# Altium project VISION_BETA_EBB.PrjPcb (part 3 of 9)

## Sheet USB.SchDoc
size D; SheetNumber: 4; SheetTotal: 18
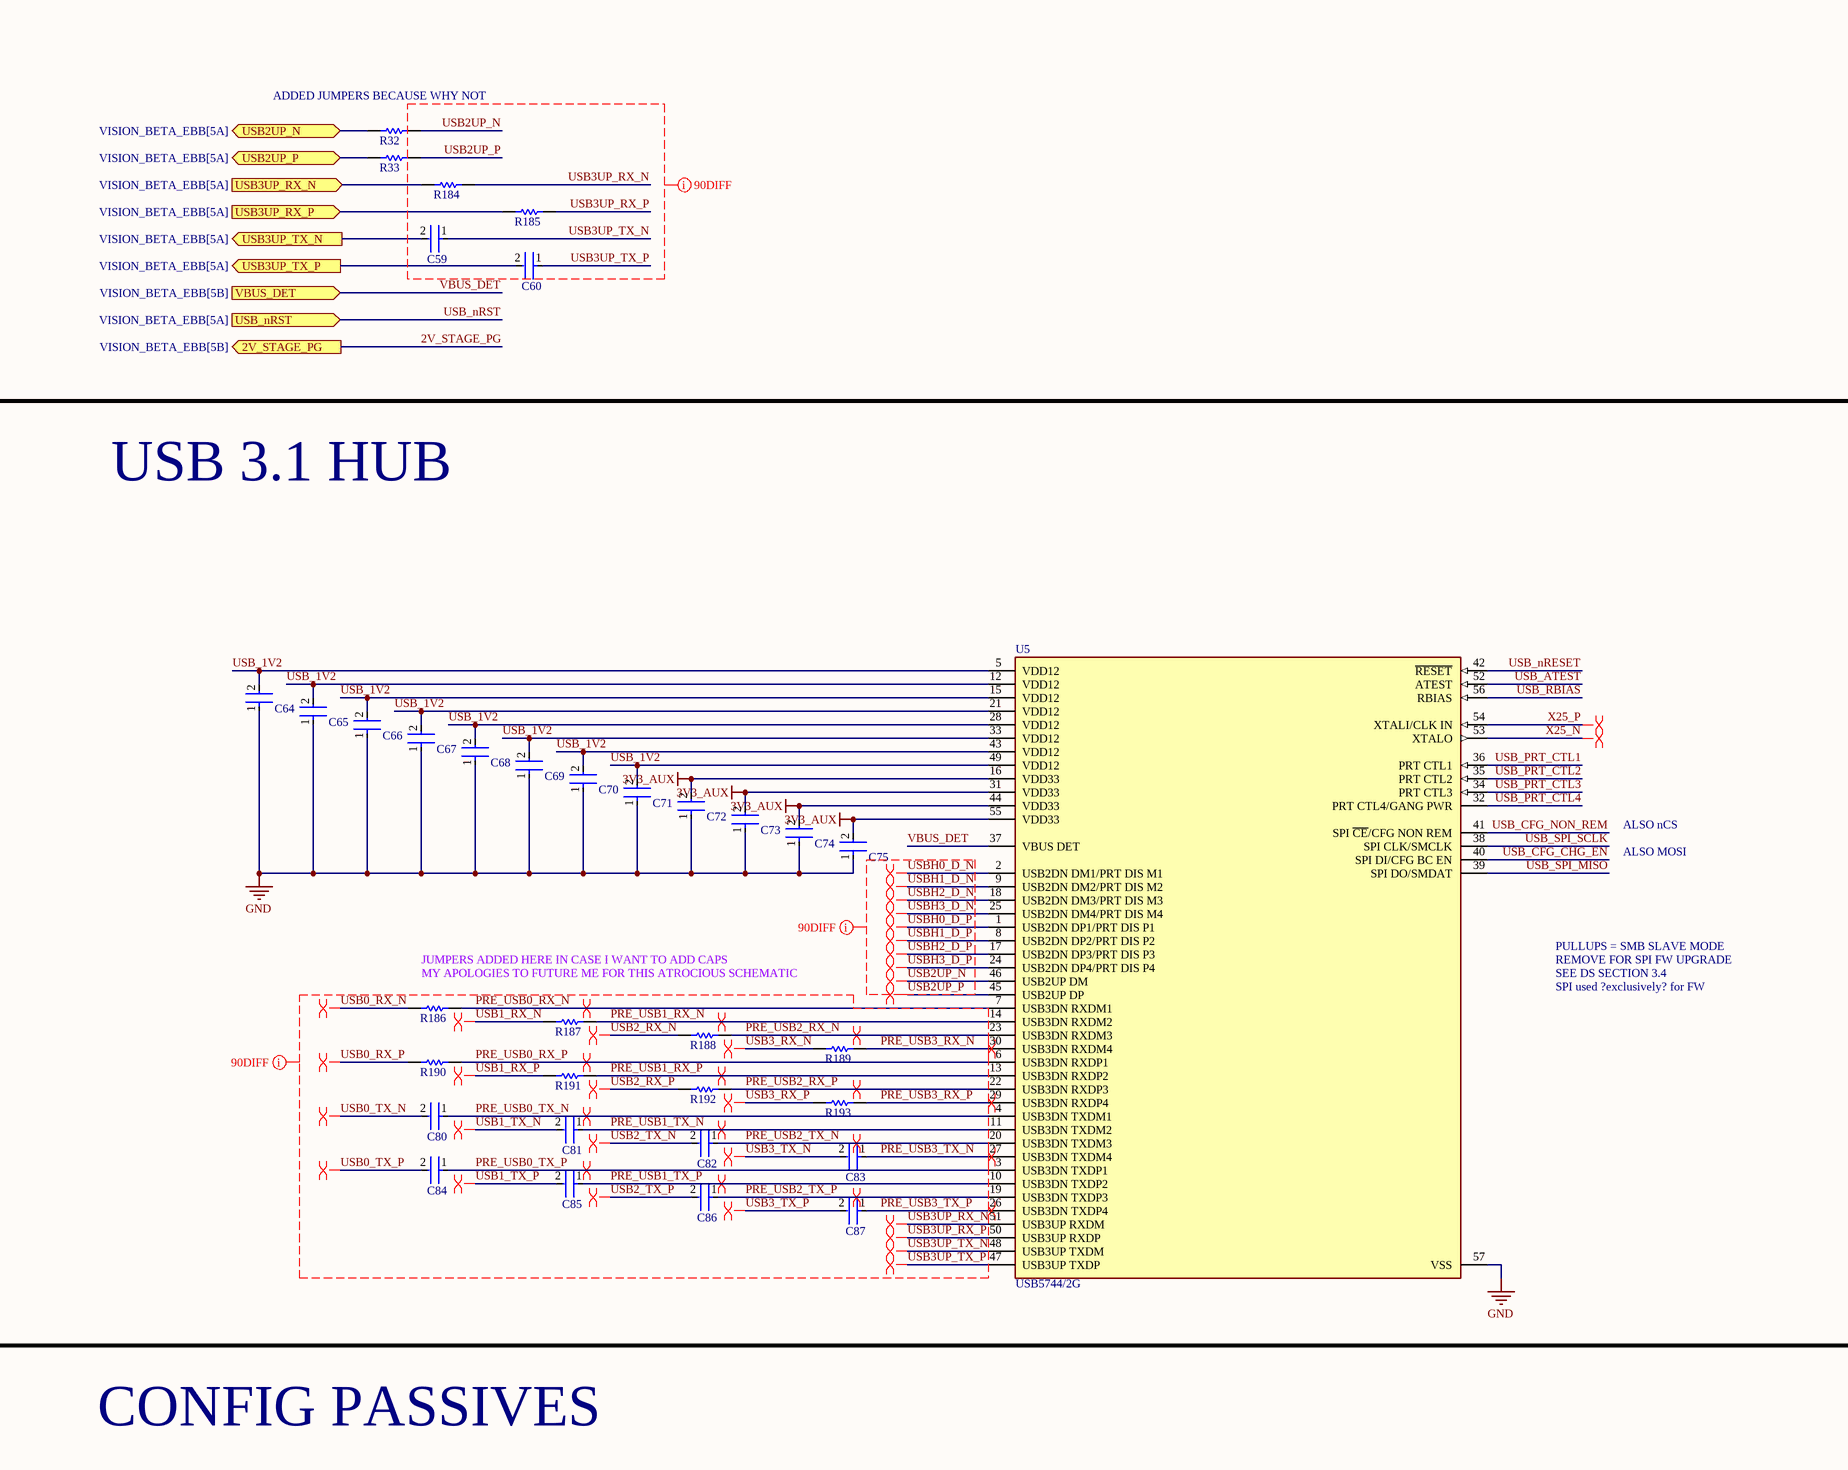
[diagram p14: USB.SchDoc, top left]
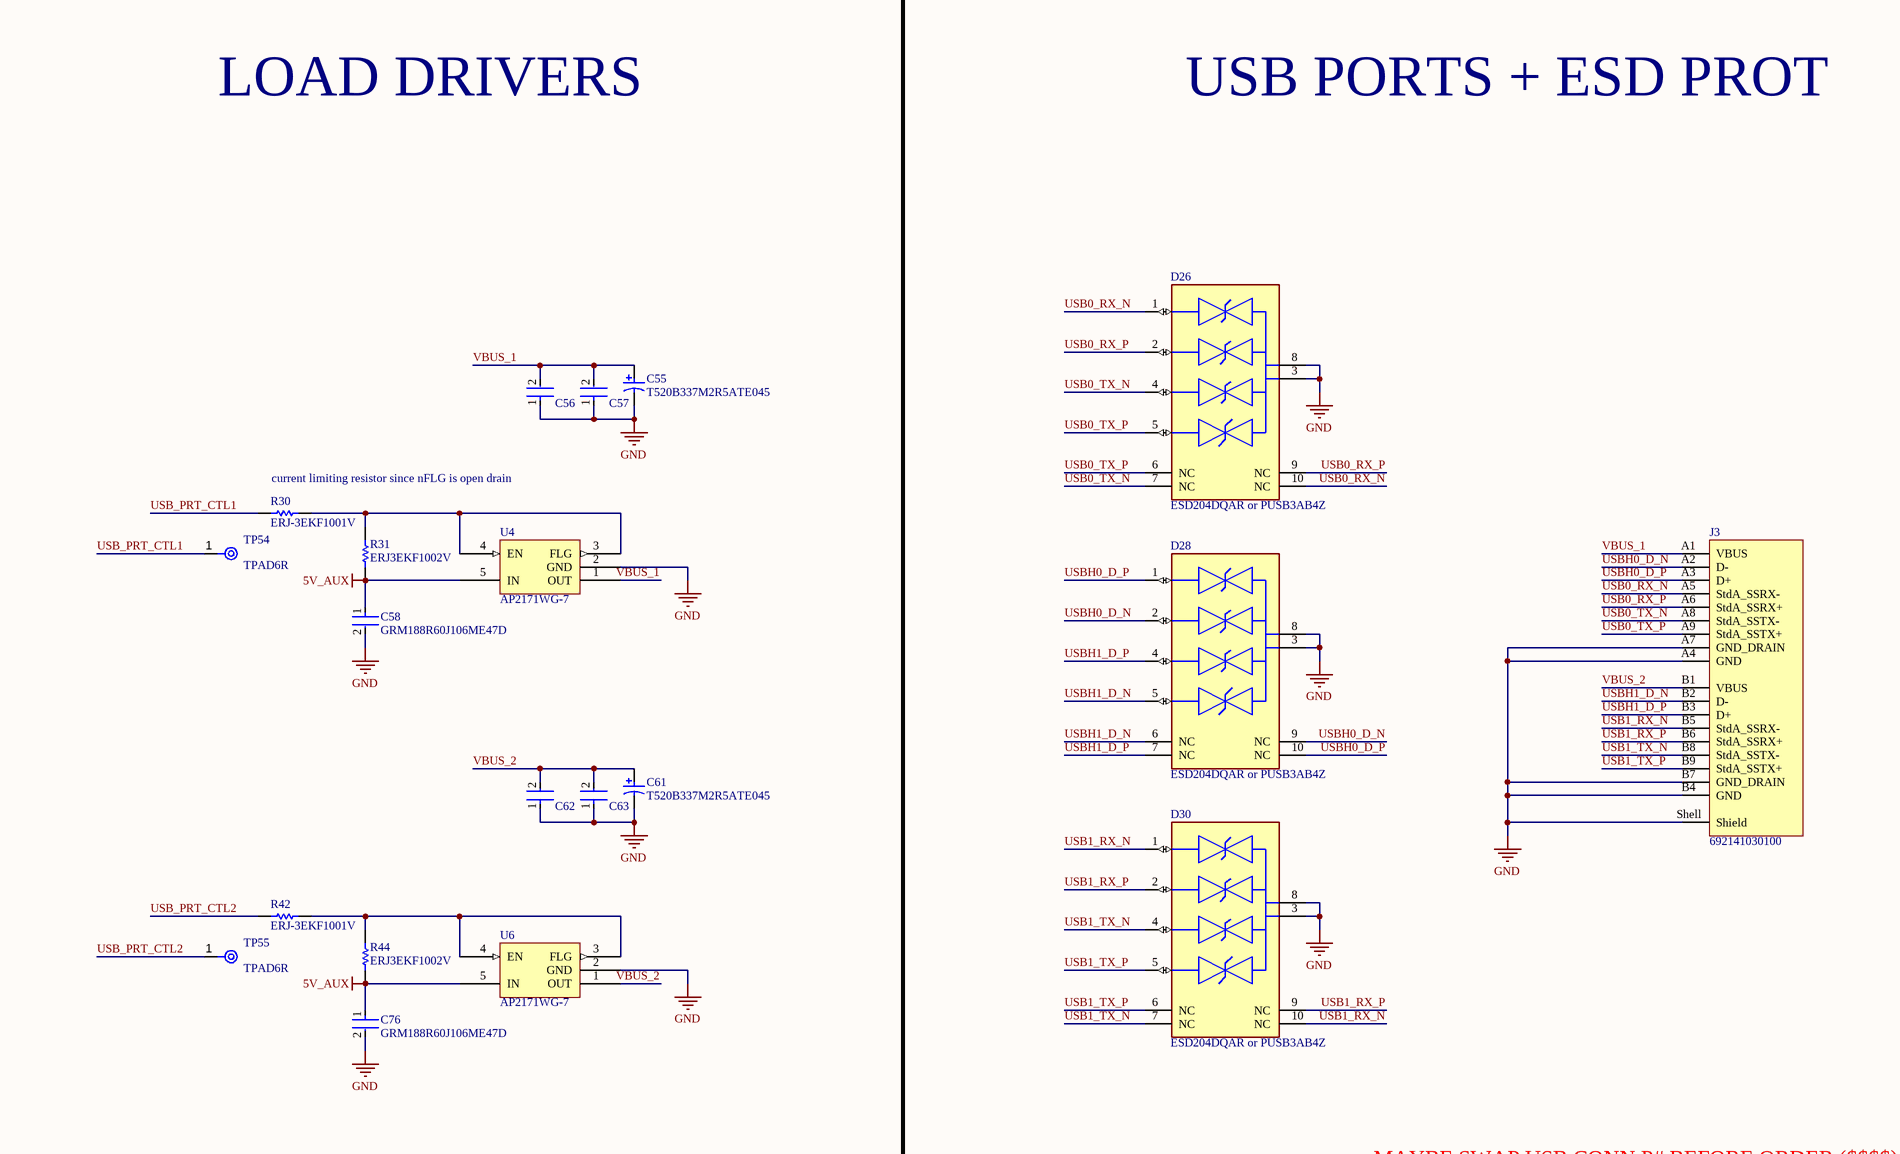
[diagram p15: USB.SchDoc, top right]
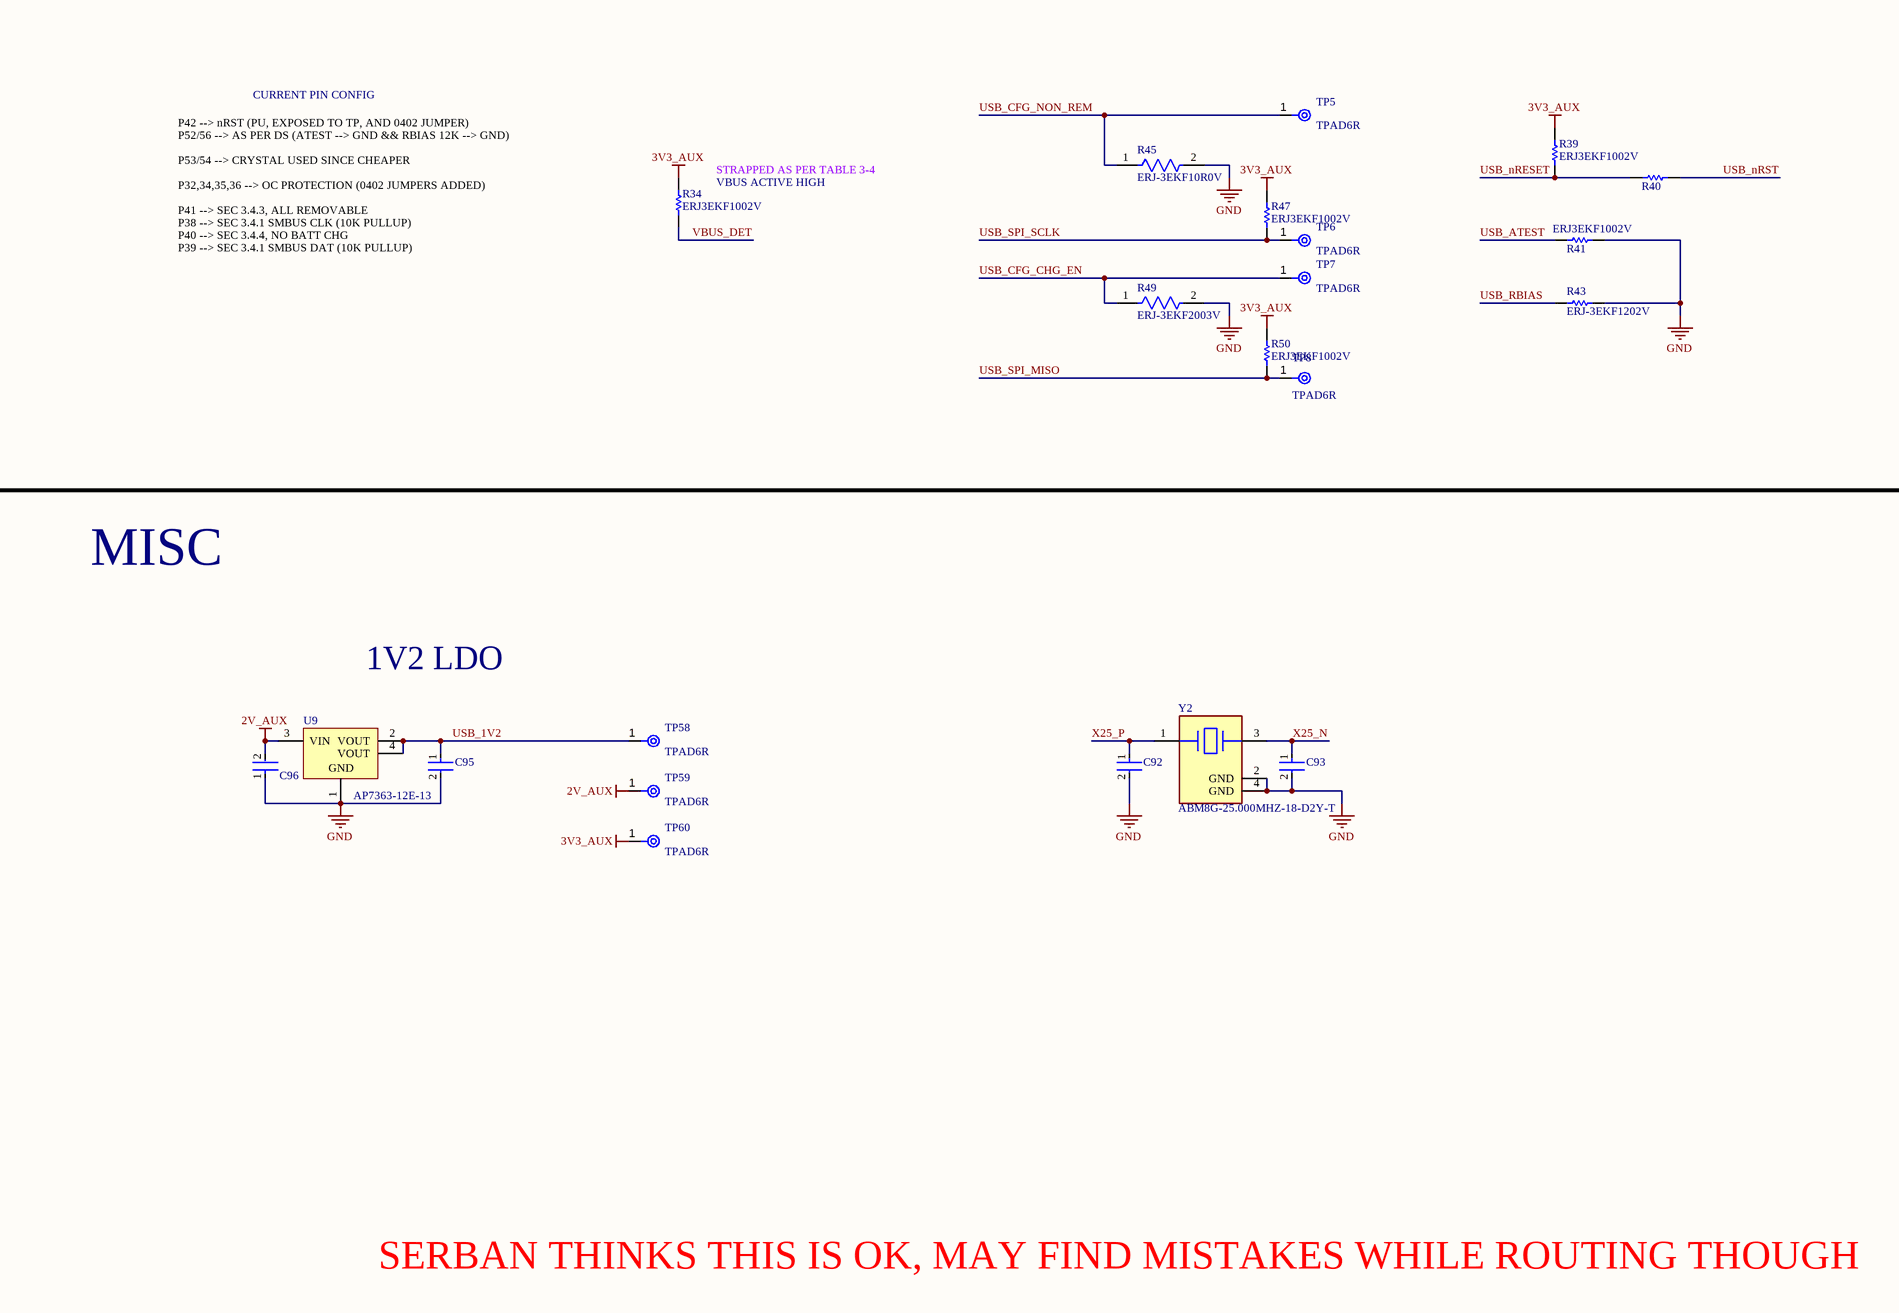
[diagram p16: USB.SchDoc, bottom left]
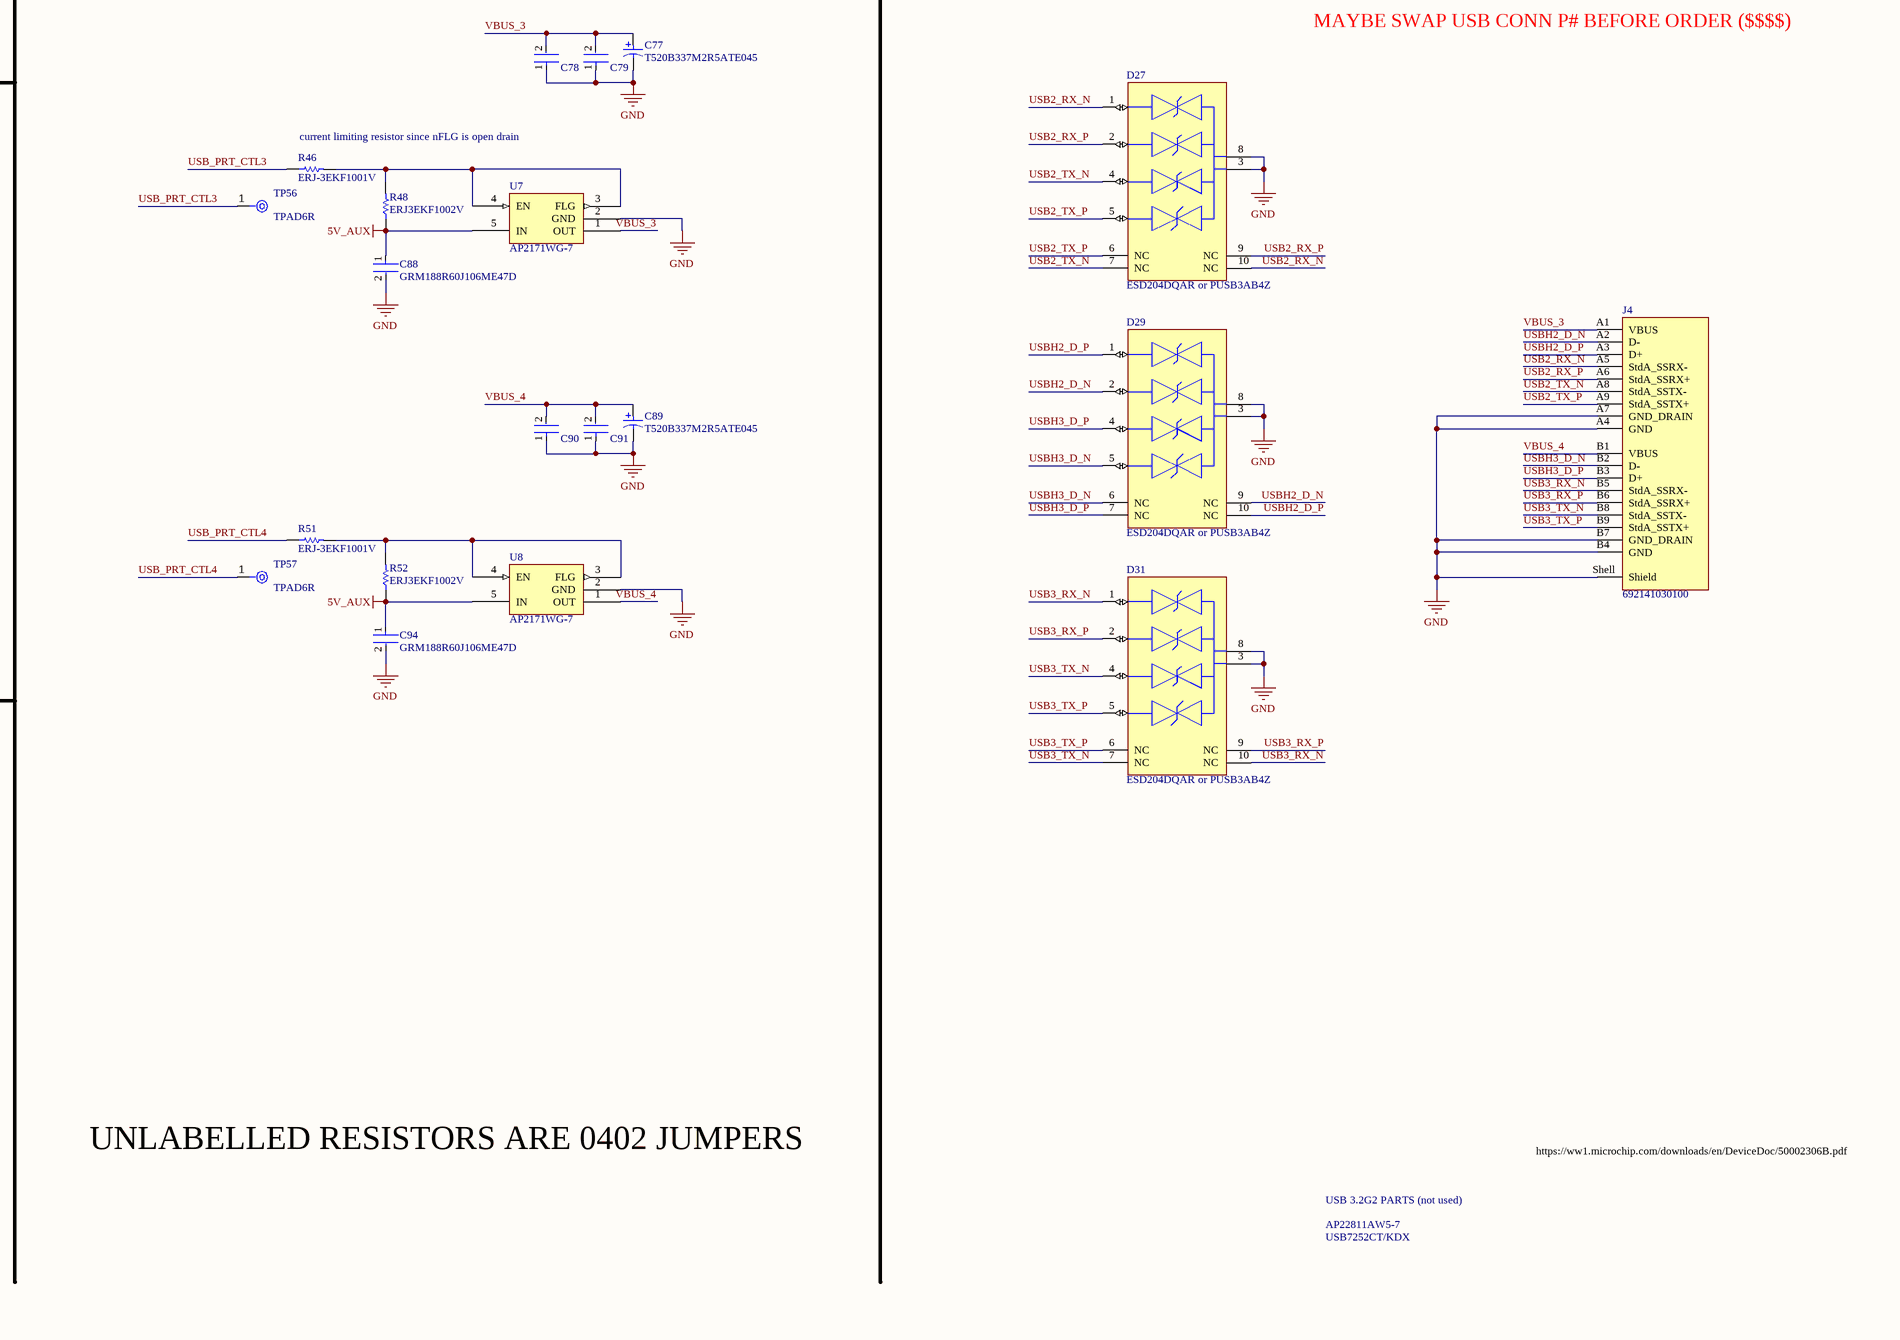
[diagram p17: USB.SchDoc, bottom right]

### Parts
C55  T520B337M2R5ATE045  [KEMT-520-B-2_M]
C56  C1005X7R1H104K050BB  [FP-C1005-050-0_05-IPC_C]  (value not drawn)
C57  C1005X7R1H104K050BB  [FP-C1005-050-0_05-IPC_C]  (value not drawn)
C58  GRM188R60J106ME47D  [FP-GRM188-0_1-e0_2_0_55-IPC_A]
C59  C1005X7R1H104K050BB  [FP-C1005-050-0_05-IPC_C]  (value not drawn)
C60  C1005X7R1H104K050BB  [FP-C1005-050-0_05-IPC_C]  (value not drawn)
C61  T520B337M2R5ATE045  [KEMT-520-B-2_M]
C62  C1005X7R1H104K050BB  [FP-C1005-050-0_05-IPC_C]  (value not drawn)
C63  C1005X7R1H104K050BB  [FP-C1005-050-0_05-IPC_C]  (value not drawn)
C64  C1005X7R1H104K050BB  [FP-C1005-050-0_05-IPC_C]  (value not drawn)
C65  C1005X7R1H104K050BB  [FP-C1005-050-0_05-IPC_C]  (value not drawn)
C66  C1005X7R1H104K050BB  [FP-C1005-050-0_05-IPC_C]  (value not drawn)
C67  C1005X7R1H104K050BB  [FP-C1005-050-0_05-IPC_C]  (value not drawn)
C68  C1005X7R1H104K050BB  [FP-C1005-050-0_05-IPC_C]  (value not drawn)
C69  C1005X7R1H104K050BB  [FP-C1005-050-0_05-IPC_C]  (value not drawn)
C70  C1005X7R1H104K050BB  [FP-C1005-050-0_05-IPC_C]  (value not drawn)
C71  C1005X7R1H104K050BB  [FP-C1005-050-0_05-IPC_C]  (value not drawn)
C72  C1005X7R1H104K050BB  [FP-C1005-050-0_05-IPC_C]  (value not drawn)
C73  C1005X7R1H104K050BB  [FP-C1005-050-0_05-IPC_C]  (value not drawn)
C74  C1005X7R1H104K050BB  [FP-C1005-050-0_05-IPC_C]  (value not drawn)
C75  C1005X7R1H104K050BB  [FP-C1005-050-0_05-IPC_C]  (value not drawn)
C76  GRM188R60J106ME47D  [FP-GRM188-0_1-e0_2_0_55-IPC_A]
C77  T520B337M2R5ATE045  [KEMT-520-B-2_M]
C78  C1005X7R1H104K050BB  [FP-C1005-050-0_05-IPC_C]  (value not drawn)
C79  C1005X7R1H104K050BB  [FP-C1005-050-0_05-IPC_C]  (value not drawn)
C80  C1005X7R1H104K050BB  [FP-C1005-050-0_05-IPC_C]  (value not drawn)
C81  C1005X7R1H104K050BB  [FP-C1005-050-0_05-IPC_C]  (value not drawn)
C82  C1005X7R1H104K050BB  [FP-C1005-050-0_05-IPC_C]  (value not drawn)
C83  C1005X7R1H104K050BB  [FP-C1005-050-0_05-IPC_C]  (value not drawn)
C84  C1005X7R1H104K050BB  [FP-C1005-050-0_05-IPC_C]  (value not drawn)
C85  C1005X7R1H104K050BB  [FP-C1005-050-0_05-IPC_C]  (value not drawn)
C86  C1005X7R1H104K050BB  [FP-C1005-050-0_05-IPC_C]  (value not drawn)
C87  C1005X7R1H104K050BB  [FP-C1005-050-0_05-IPC_C]  (value not drawn)
C88  GRM188R60J106ME47D  [FP-GRM188-0_1-e0_2_0_55-IPC_A]
C89  T520B337M2R5ATE045  [KEMT-520-B-2_M]
C90  C1005X7R1H104K050BB  [FP-C1005-050-0_05-IPC_C]  (value not drawn)
C91  C1005X7R1H104K050BB  [FP-C1005-050-0_05-IPC_C]  (value not drawn)
C92  C0603C300J5GACTU  [FP-C0603C-CF-MFG]  (value not drawn)
C93  C0603C300J5GACTU  [FP-C0603C-CF-MFG]  (value not drawn)
C94  GRM188R60J106ME47D  [FP-GRM188-0_1-e0_2_0_55-IPC_A]
C95  GRM188R60J106ME47D  [FP-GRM188-0_1-e0_2_0_55-IPC_A]  (value not drawn)
C96  C1005X7R1H104K050BB  [FP-C1005-050-0_05-IPC_C]  (value not drawn)
D26  ESD204DQAR or PUSB3AB4Z  [FP-DQA0010A-MFG]
D27  ESD204DQAR or PUSB3AB4Z  [FP-DQA0010A-MFG]
D28  ESD204DQAR or PUSB3AB4Z  [FP-DQA0010A-MFG]
D29  ESD204DQAR or PUSB3AB4Z  [FP-DQA0010A-MFG]
D30  ESD204DQAR or PUSB3AB4Z  [FP-DQA0010A-MFG]
D31  ESD204DQAR or PUSB3AB4Z  [FP-DQA0010A-MFG]
J3  692141030100  [692141030100]
J4  692141030100  [692141030100]
R30  ERJ-3EKF1001V  [RESC1608X55X30LL15T15]
R31  ERJ3EKF1002V  [RESC1609X55X30LL15T15]
R32  0402 JUMPER  [RESC1005X40X25ML05T05]  (value not drawn)
R33  0402 JUMPER  [RESC1005X40X25ML05T05]  (value not drawn)
R34  ERJ3EKF1002V  [RESC1609X55X30LL15T15]
R39  ERJ3EKF1002V  [RESC1609X55X30LL15T15]
R40  0402 JUMPER  [RESC1005X40X25ML05T05]  (value not drawn)
R41  ERJ3EKF1002V  [RESC1609X55X30LL15T15]
R42  ERJ-3EKF1001V  [RESC1608X55X30LL15T15]
R43  ERJ-3EKF1202V  [RESC1609X55X30ML15T15]
R44  ERJ3EKF1002V  [RESC1609X55X30LL15T15]
R45  ERJ-3EKF10R0V  [FP-ERJ3EK-MFG]
R46  ERJ-3EKF1001V  [RESC1608X55X30LL15T15]
R47  ERJ3EKF1002V  [RESC1609X55X30LL15T15]
R48  ERJ3EKF1002V  [RESC1609X55X30LL15T15]
R49  ERJ-3EKF2003V  [FP-ERJ3EK-IPC_B]
R50  ERJ3EKF1002V  [RESC1609X55X30LL15T15]
R51  ERJ-3EKF1001V  [RESC1608X55X30LL15T15]
R52  ERJ3EKF1002V  [RESC1609X55X30LL15T15]
R184  0402 JUMPER  [RESC1005X40X25ML05T05]  (value not drawn)
R185  0402 JUMPER  [RESC1005X40X25ML05T05]  (value not drawn)
R186  0402 JUMPER  [RESC1005X40X25ML05T05]  (value not drawn)
R187  0402 JUMPER  [RESC1005X40X25ML05T05]  (value not drawn)
R188  0402 JUMPER  [RESC1005X40X25ML05T05]  (value not drawn)
R189  0402 JUMPER  [RESC1005X40X25ML05T05]  (value not drawn)
R190  0402 JUMPER  [RESC1005X40X25ML05T05]  (value not drawn)
R191  0402 JUMPER  [RESC1005X40X25ML05T05]  (value not drawn)
R192  0402 JUMPER  [RESC1005X40X25ML05T05]  (value not drawn)
R193  0402 JUMPER  [RESC1005X40X25ML05T05]  (value not drawn)
TP5  TPAD6R  [New footprint 1]
TP6  TPAD6R  [New footprint 1]
TP7  TPAD6R  [New footprint 1]
TP8  TPAD6R  [New footprint 1]
TP54  TPAD6R  [New footprint 1]
TP55  TPAD6R  [New footprint 1]
TP56  TPAD6R  [New footprint 1]
TP57  TPAD6R  [New footprint 1]
TP58  TPAD6R  [New footprint 1]
TP59  TPAD6R  [New footprint 1]
TP60  TPAD6R  [New footprint 1]
U4  AP2171WG-7  [SOT95P285X130-5N]
U5  USB5744/2G  [FP-USB5744-2G-MFG]
U6  AP2171WG-7  [SOT95P285X130-5N]
U7  AP2171WG-7  [SOT95P285X130-5N]
U8  AP2171WG-7  [SOT95P285X130-5N]
U9  AP7363-12E-13  [SOT-223_M]
Y2  ABM8G-25.000MHZ-18-D2Y-T  [FP-ABM8G-MFG]

### Ports
2V_STAGE_PG (out, see VISION_BETA_EBB[5B]), USB2UP_N (bidir, see VISION_BETA_EBB[5A]), USB2UP_P (bidir, see VISION_BETA_EBB[5A]), USB3UP_RX_N (in, see VISION_BETA_EBB[5A]), USB3UP_RX_P (in, see VISION_BETA_EBB[5A]), USB3UP_TX_N (out, see VISION_BETA_EBB[5A]), USB3UP_TX_P (out, see VISION_BETA_EBB[5A]), USB_nRST (in, see VISION_BETA_EBB[5A]), VBUS_DET (in, see VISION_BETA_EBB[5B])

### Nets
2V_AUX: C96.2 TP59.1(TP) U9.3(VIN)  [project net 2V_AUX_OUT]
3V3_AUX: C72.2 C73.2 C74.2 C75.2 R34.2 R39.2 R47.2 R50.2 TP60.1(TP) U5.16(VDD33) U5.31(VDD33) U5.44(VDD33) U5.55(VDD33)  [project net 3V3_AUX_FB]
5V_AUX: C58.1 C76.1 C88.1 C94.1 R31.1 R44.1 R48.1 R52.1 U4.5(IN) U6.5(IN) U7.5(IN) U8.5(IN)  [project net 5V_REG_FB]
GND: C55.2 C56.1 C57.1 C58.2 C61.2 C62.1 C63.1 C64.1 C65.1 C66.1 C67.1 C68.1 C69.1 C70.1 C71.1 C72.1 C73.1 C74.1 C75.1 C76.2 C77.2 C78.1 C79.1 C88.2 C89.2 C90.1 C91.1 C92.2 C93.2 C94.2 C95.2 C96.1 D26.3(GND) D26.8(GND) D27.3(GND) D27.8(GND) D28.3(GND) D28.8(GND) D29.3(GND) D29.8(GND) D30.3(GND) D30.8(GND) D31.3(GND) D31.8(GND) J3.A4(GND) J3.A7(GND_DRAIN) J3.B4(GND) J3.B7(GND_DRAIN) J3.Shell(Shield) J4.A4(GND) J4.A7(GND_DRAIN) J4.B4(GND) J4.B7(GND_DRAIN) J4.Shell(Shield) R41.1 R43.2 R45.2 R49.2 U4.2(GND) U5.57(VSS) U6.2(GND) U7.2(GND) U8.2(GND) U9.1(GND) Y2.2(GND) Y2.4(GND)
2V_STAGE_PG: port 2V_STAGE_PG
PRE_USB0_RX_N: R186.2 U5.7(USB3DN_RXDM1)
PRE_USB0_RX_P: R190.2 U5.6(USB3DN_RXDP1)
PRE_USB0_TX_N: C80.1 U5.4(USB3DN_TXDM1)
PRE_USB0_TX_P: C84.1 U5.3(USB3DN_TXDP1)
PRE_USB1_RX_N: R187.2 U5.14(USB3DN_RXDM2)
PRE_USB1_RX_P: R191.2 U5.13(USB3DN_RXDP2)
PRE_USB1_TX_N: C81.1 U5.11(USB3DN_TXDM2)
PRE_USB1_TX_P: C85.1 U5.10(USB3DN_TXDP2)
PRE_USB2_RX_N: R188.2 U5.23(USB3DN_RXDM3)
PRE_USB2_RX_P: R192.2 U5.22(USB3DN_RXDP3)
PRE_USB2_TX_N: C82.1 U5.20(USB3DN_TXDM3)
PRE_USB2_TX_P: C86.1 U5.19(USB3DN_TXDP3)
PRE_USB3_RX_N: R189.2 U5.30(USB3DN_RXDM4)
PRE_USB3_RX_P: R193.2 U5.29(USB3DN_RXDP4)
PRE_USB3_TX_N: C83.1 U5.27(USB3DN_TXDM4)
PRE_USB3_TX_P: C87.1 U5.26(USB3DN_TXDP4)
USB0_RX_N: D26.1(IO1) D26.10(NC) J3.A5(StdA_SSRX-) R186.1
USB0_RX_P: D26.2(IO2) D26.9(NC) J3.A6(StdA_SSRX+) R190.1
USB0_TX_N: C80.2 D26.4(IO3) D26.7(NC) J3.A8(StdA_SSTX-)
USB0_TX_P: C84.2 D26.5(IO4) D26.6(NC) J3.A9(StdA_SSTX+)
USB1_D_N: R32.1 ; port USB2UP_N
USB1_D_P: R33.1 ; port USB2UP_P
USB1_RX_N: D30.1(IO1) D30.10(NC) J3.B5(StdA_SSRX-) R187.1
USB1_RX_P: D30.2(IO2) D30.9(NC) J3.B6(StdA_SSRX+) R191.1
USB1_TX_N: C81.2 D30.4(IO3) D30.7(NC) J3.B8(StdA_SSTX-)
USB1_TX_P: C85.2 D30.5(IO4) D30.6(NC) J3.B9(StdA_SSTX+)
USB2_RX_N: D27.1(IO1) D27.10(NC) J4.A5(StdA_SSRX-) R188.1
USB2_RX_P: D27.2(IO2) D27.9(NC) J4.A6(StdA_SSRX+) R192.1
USB2_TX_N: C82.2 D27.4(IO3) D27.7(NC) J4.A8(StdA_SSTX-)
USB2_TX_P: C86.2 D27.5(IO4) D27.6(NC) J4.A9(StdA_SSTX+)
USB2UP_N: R32.2 U5.46(USB2UP_DM)
USB2UP_P: R33.2 U5.45(USB2UP_DP)
USB3_RX_N: D31.1(IO1) D31.10(NC) J4.B5(StdA_SSRX-) R189.1
USB3_RX_P: D31.2(IO2) D31.9(NC) J4.B6(StdA_SSRX+) R193.1
USB3_TX_N: C83.2 D31.4(IO3) D31.7(NC) J4.B8(StdA_SSTX-)
USB3_TX_P: C87.2 D31.5(IO4) D31.6(NC) J4.B9(StdA_SSTX+)
USB3UP_RX_N: R184.2 U5.51(USB3UP_RXDM)
USB3UP_RX_P: R185.2 U5.50(USB3UP_RXDP)
USB3UP_TX_N: C59.1 U5.48(USB3UP_TXDM)
USB3UP_TX_P: C60.1 U5.47(USB3UP_TXDP)
USB_1V2: C64.2 C65.2 C66.2 C67.2 C68.2 C69.2 C70.2 C71.2 C95.1 TP58.1(TP) U5.5(VDD12) U5.12(VDD12) U5.15(VDD12) U5.21(VDD12) U5.28(VDD12) U5.33(VDD12) U5.43(VDD12) U5.49(VDD12) U9.2(VOUT) U9.4(VOUT)
USB_ATEST: R41.2 U5.52(ATEST)
USB_CFG_CHG_EN: R49.1 TP7.1(TP) U5.40(SPI_DI/CFG_BC_EN)
USB_CFG_NON_REM: R45.1 TP5.1(TP) U5.41(SPI_~{CE}/CFG_NON_REM)
USB_nRESET: R39.1 R40.1 U5.42(~{RESET})
USB_nRST: R40.2 ; port USB_nRST
USB_PRT_CTL1: R30.1 TP54.1(TP) U5.36(PRT_CTL1)
USB_PRT_CTL2: R42.1 TP55.1(TP) U5.35(PRT_CTL2)
USB_PRT_CTL3: R46.1 TP56.1(TP) U5.34(PRT_CTL3)
USB_PRT_CTL4: R51.1 TP57.1(TP) U5.32(PRT_CTL4/GANG_PWR)
USB_RBIAS: R43.1 U5.56(RBIAS)
USB_SPI_MISO: R50.1 TP8.1(TP) U5.39(SPI_DO/SMDAT)
USB_SPI_SCLK: R47.1 TP6.1(TP) U5.38(SPI_CLK/SMCLK)
USBH0_D_N: D28.2(IO2) D28.9(NC) J3.A2(D-) U5.2(USB2DN_DM1/PRT_DIS_M1)
USBH0_D_P: D28.1(IO1) D28.10(NC) J3.A3(D+) U5.1(USB2DN_DP1/PRT_DIS_P1)
USBH1_D_N: D28.5(IO4) D28.6(NC) J3.B2(D-) U5.9(USB2DN_DM2/PRT_DIS_M2)
USBH1_D_P: D28.4(IO3) D28.7(NC) J3.B3(D+) U5.8(USB2DN_DP2/PRT_DIS_P2)
USBH2_D_N: D29.2(IO2) D29.9(NC) J4.A2(D-) U5.18(USB2DN_DM3/PRT_DIS_M3)
USBH2_D_P: D29.1(IO1) D29.10(NC) J4.A3(D+) U5.17(USB2DN_DP3/PRT_DIS_P3)
USBH3_D_N: D29.5(IO4) D29.6(NC) J4.B2(D-) U5.25(USB2DN_DM4/PRT_DIS_M4)
USBH3_D_P: D29.4(IO3) D29.7(NC) J4.B3(D+) U5.24(USB2DN_DP4/PRT_DIS_P4)
USBSS0_RX_N: R184.1 ; port USB3UP_RX_N
USBSS0_RX_P: R185.1 ; port USB3UP_RX_P
USBSS0_TX_N: C59.2 ; port USB3UP_TX_N
USBSS0_TX_P: C60.2 ; port USB3UP_TX_P
VBUS_1: C55.1 C56.2 C57.2 J3.A1(VBUS) U4.1(OUT)
VBUS_2: C61.1 C62.2 C63.2 J3.B1(VBUS) U6.1(OUT)
VBUS_3: C77.1 C78.2 C79.2 J4.A1(VBUS) U7.1(OUT)
VBUS_4: C89.1 C90.2 C91.2 J4.B1(VBUS) U8.1(OUT)
VBUS_DET: R34.1 U5.37(VBUS_DET) ; port VBUS_DET
X25_N: C93.1 U5.53(XTALO) Y2.3
X25_P: C92.1 U5.54(XTALI/CLK_IN) Y2.1
NetR30_2: R30.2 R31.2 U4.3(FLG) U4.4(EN)
NetR42_2: R42.2 R44.2 U6.3(FLG) U6.4(EN)
NetR46_2: R46.2 R48.2 U7.3(FLG) U7.4(EN)
NetR51_2: R51.2 R52.2 U8.3(FLG) U8.4(EN)

### Layout directives
differential pair; differential pair class 90DIFF: PRE_USB0_RX_N, PRE_USB0_RX_P, PRE_USB0_TX_N, PRE_USB0_TX_P, PRE_USB1_RX_N, PRE_USB1_RX_P, PRE_USB1_TX_N, PRE_USB1_TX_P, PRE_USB2_RX_N, PRE_USB2_RX_P, PRE_USB2_TX_N, PRE_USB2_TX_P, PRE_USB3_RX_N, PRE_USB3_RX_P, PRE_USB3_TX_N, PRE_USB3_TX_P, USB0_RX_N, USB0_RX_P, USB0_TX_N, USB0_TX_P, USB1_RX_N, USB1_RX_P, USB1_TX_N, USB1_TX_P, USB2_RX_N, USB2_RX_P, USB2_TX_N, USB2_TX_P, USB2UP_N, USB2UP_P, USB3_RX_N, USB3_RX_P, USB3_TX_N, USB3_TX_P, USB3UP_RX_N, USB3UP_RX_P, USB3UP_TX_N, USB3UP_TX_P, USBH0_D_N, USBH0_D_P, USBH1_D_N, USBH1_D_P, USBH2_D_N, USBH2_D_P, USBH3_D_N, USBH3_D_P
differential pair: X25_N, X25_P
net class 90DIFF: PRE_USB0_RX_N, PRE_USB0_RX_P, PRE_USB0_TX_N, PRE_USB0_TX_P, PRE_USB1_RX_N, PRE_USB1_RX_P, PRE_USB1_TX_N, PRE_USB1_TX_P, PRE_USB2_RX_N, PRE_USB2_RX_P, PRE_USB2_TX_N, PRE_USB2_TX_P, PRE_USB3_RX_N, PRE_USB3_RX_P, PRE_USB3_TX_N, PRE_USB3_TX_P, USB0_RX_N, USB0_RX_P, USB0_TX_N, USB0_TX_P, USB1_RX_N, USB1_RX_P, USB1_TX_N, USB1_TX_P, USB2_RX_N, USB2_RX_P, USB2_TX_N, USB2_TX_P, USB2UP_N, USB2UP_P, USB3_RX_N, USB3_RX_P, USB3_TX_N, USB3_TX_P, USB3UP_RX_N, USB3UP_RX_P, USB3UP_TX_N, USB3UP_TX_P, USBH0_D_N, USBH0_D_P, USBH1_D_N, USBH1_D_P, USBH2_D_N, USBH2_D_P, USBH3_D_N, USBH3_D_P

### Notes on the sheet
- (near R32) ADDED JUMPERS BECAUSE WHY NOT
- LOAD DRIVERS
- USB PORTS + ESD PROT
- USB 3.1 HUB
- (near R30) current limiting resistor since nFLG is open drain
- ALSO nCS
- ALSO MOSI
- JUMPERS ADDED HERE IN CASE I WANT TO ADD CAPS
- PULLUPS = SMB SLAVE MODE
- REMOVE FOR SPI FW UPGRADE
- MY APOLOGIES TO FUTURE ME FOR THIS ATROCIOUS SCHEMATIC
- SPI used ?exclusively? for FW
- SEE DS SECTION 3.4
- MAYBE SWAP USB CONN P# BEFORE ORDER ($$$$)
- CONFIG PASSIVES
- (near R46) current limiting resistor since nFLG is open drain
- CURRENT PIN CONFIG
- (near R34) VBUS ACTIVE HIGH
- (near R34) STRAPPED AS PER TABLE 3-4
- P42 --> nRST (PU, EXPOSED TO TP, AND 0402 JUMPER)
  P52/56 --> AS PER DS (ATEST --> GND && RBIAS 12K --> GND)
  P53/54 --> CRYSTAL USED SINCE CHEAPER
  P32,34,35,36 --> OC PROTECTION (0402 JUMPERS ADDED)
  P41 --> SEC 3.4.3, ALL REMOVABLE
  P38 --> SEC 3.4.1 SMBUS CLK (10K PULLUP)
  P40 --> SEC 3.4.4, NO BATT CHG
  P39 --> SEC 3.4.1 SMBUS DAT (10K PULLUP)
- MISC
- 1V2 LDO
- UNLABELLED RESISTORS ARE 0402 JUMPERS
- https://ww1.microchip.com/downloads/en/DeviceDoc/50002306B.pdf
- USB 3.2G2 PARTS (not used)
- AP22811AW5-7
- USB7252CT/KDX
- SERBAN THINKS THIS IS OK, MAY FIND MISTAKES WHILE ROUTING THOUGH

### Library data of the parts
C55 C61 C77 C89 = CMP-1664-00002-2: Tantalum Capacitor, 330 uF, +/- 20%, 2.5 V, -55 to 105 degC, 2-Pin Molded, RoHS, Tape and Reel; Capacitance: 330 uF; PartNumber: T520B337M2R5ATE045; DatasheetVersion: 07/2016; Radiation Hardening: No; ComponentLink2Description: Datasheet; PackageDescription: 2-Pin Surface Mount Device, Body 3.5 x 2.8 mm; Width: 2.8 mm; ComponentLink2URL: http://capacitoredge.kemet.com/capedge2/DataSheet?pn=T520B337M2R5ATE045; Case/Package: 1411; Length: 3.5 mm; Package Quantity: 2000; Max Operating Temperature: 105 degC; Mounting Technology: Surface Mount; Height: 2.1 mm; RoHSCompliant: True; ComponentLink1URL: http://www.kemet.com/; Mount: Surface Mount; Packaging: Tape and Reel; ComponentLink1Description: Manufacturer URL; Min Operating Temperature: -55 degC
C56 C57 C59 C60 C62-C75 C78-C87 C90 C91 C96 = CMP-2000-05393-2: as C214 on sheet JETSON; Voltage: 50V; Dielectric Material: Ceramic; Min Operating Temperature: -55°C; Depth: 0.5mm; Radiation Hardening: No; RoHS Compliant: Yes; Voltage Rating (DC): 50V; Lead Free: Lead Free; Resistor Type: Ceramic; Height: 0.5mm; Dielectric: X7R; Thickness: 0.022inch; Case/Package: 0402; Case Code (Metric): 1005; Termination: SMD/SMT; Capacitance: 100nF; Packaging: Tape and Reel; Max Operating Temperature: 125°C; Mount: Surface Mount; Package Quantity: 1; Width: 0.02inch; Weight: 2.3E-05oz; Voltage Rating: 50V; Tolerance: 10%; Construction: Flat; Case Code (Imperial): 0402; Length: 1mm; REACH SVHC: No SVHC; Series: C
C58 C76 C88 C94 C95 = CMP-2006-02792-2: as C213 on sheet JETSON; Packaging: Tape and Reel; Voltage Rating (DC): 6.3V; Width: 0.031inch; Termination: SMD/SMT; Dielectric: X5R; Package Quantity: 4000; Voltage Rating: 6.3V; Capacitance: 10uF; Case/Package: 0603; Min Operating Temperature: -55°C; Voltage: 6.3V; Length: 1.6mm; Thickness: 0.035inch; Lead Free: Lead Free; Depth: 0.8mm; Case Code (Imperial): 0603; Max Operating Temperature: 85°C; Material: Ceramic; Height: 0.8mm; Tolerance: 20%; Mount: Surface Mount; REACH SVHC: No SVHC; Radiation Hardening: No; Case Code (Metric): 1608
C92 C93 = CMP-1035-00914-3: CAP CER 30PF 50V 5% NP0 0603; Manufacturer: KEMET; Automotive Grade: Grade 1; Temperature Coefficient: 30ppm/°C; Material: Ceramic; Temperature Characteristic: C0G; Tolerance: 0.05; Manufacturer Part Number: C0603C300J5GACTU; ComponentLink2URL: https://api.kemet.com/component-edge/download/datasheet/C0603C100J5GACAUTO.pdf; Automotive: Yes; Device Class L2: Capacitors; Device Class L1: Passive Components; Device Class L3: Ceramic Capacitors; RoHS: TRUE; Octopart: https://octopart.com/c0603c300j5gactu-kemet-199455; Lead Free: Yes; Value: 30 pF; Temperature Range High: +125°C; Category: Cap; Temperature: -55°C to +125°C; Package: C0603C-CF; Capacitance: 30 pF; Digikey Description: CAP CER 30PF 50V 5% NP0 0603; Height: 0.87mm; ComponentLink2Description: Datasheet; Temperature Range Low: -55°C; Mouser Description: Multilayer Ceramic Capacitors MLCC - SMD/SMT 50volts 30pF C0G 5%; Voltage Rating: 50 V
D26-D31 = CMP-04989-000002-1: as D1 on sheet JETSON; Ambient Temperature Range High: +125°C; ComponentLink2Description: Datasheet; Height: 0.55mm; Lead Free: Yes; Device Class L3: unset; Temperature Range High: +125°C; Temperature Range Low: -40°C; Package: DQA0010A; Temperature: -40°C to +125°C; Capacitance: 0.55pF; RoHS: TRUE; Mouser Description: 4-Channel Low-Capacitance Surge and ESD Protection Diode 10-USON -40 to 125; Category: Diode; Device Class L1: Circuit Protection; Octopart: https://octopart.com/esd204dqar-texas+instruments-89917476; Device Class L2: TVS Diodes; Ambient Temperature Range Low: -40°C; Manufacturer Part Number: ESD204DQAR; ComponentLink2URL: http://www.ti.com/lit/ds/symlink/esd204.pdf; Automotive: No; Digikey Description: 4-CHANNEL LOW-CAPACITANCE SURGE
J3 J4 = CMP-1502-03222-3: NexarPartId: 19667819; Connector Type: USB; Contact Resistance: 50mΩ; USB Standard: USB 3.0; Insulation Resistance: 100MΩ; Number of Contacts: 18; Gender: Receptacle; Number of Ports: 2; Voltage Rating (AC): 30V; Current Rating: 1.8A; Min Operating Temperature: -40°C; Max Operating Temperature: 85°C; Lead Free: Lead Free; Features: Shielded; Width: 19.7mm; Length: 15.59mm; Flammability Rating: UL94 V-0; Contact Plating: Gold; RoHS: Compliant; Number of Pins: 18; Termination: Through Hole; Contact Material: Bronze, Gold, Nickel; Mount: Horizontal, Through Hole; Voltage Rating: 30V; Operating Supply Voltage: 30V; REACH SVHC: Unknown; Orientation: Right Angle; Color: Blue; Height: 16.335mm
R30 R42 R46 R51 = CMP-2000-00180-1: Manufacturer: Panasonic; Part Number: ERJ-3EKF1001V
R31 R34 R39 R41 R44 R47 R48 R50 R52 = CMP-1012-00623-3: as R62 on sheet JETSON; Number of Pins: 2; Package Reference: 603; Depth: 0.8mm; Mount: SurfaceMount; Package Description: 2-Pin Surface Mount Device, Body 1.6 x 0.85 mm; Datasheet Version: 02/2017; Length: 1.6mm; Lead Free: LeadFree; Height: 0.45mm; Number of Terminations: 2; Max Power Dissipation: 100mW; Min Operating Temperature: -55degC; Datasheet URL: https://industrial.panasonic.com/cdbs/www-data/pdf/RDA0000/AOA0000C304.pdf; Termination: SMD/SMT; Case Code (Metric): 1608; Case Code (Imperial): 0603; Tolerance: 1%; Max Operating Temperature: 155degC; RoHSCompliant: true; Voltage Rating (DC): 75V; Radiation Hardening: No; Packaging: TapeandReel; Composition: ThickFilm; Mounting Technology: SurfaceMount; Manufacturer URL: http://www.panasonic.com/; Width: 0.031inch; REACH SVHC: NoSVHC; Contact Plating: Tin; Military Standard: Not; Package Quantity: 1
R32 R33 R40 R184-R193 = CMP-009-00118-2: READ THE NAME; Pins: 2; Component Type: Standard; Design Item ID: CMP-009-00206-2; Source: 0402jump.SchLib
R43 = CMP-1012-00631-3: Chip Resistor, 12 KOhm, +/- 1%, 0.1 W, -55 to 155 degC, 0603 (1608 Metric), RoHS, Tape and Reel; Manufacturer: Panasonic; Power Rating: 100mW; Temperature Coefficient: 100ppm/degreesC; Voltage Rating (DC): 75V; Resistance: 12KOhm; REACH SVHC: NoSVHC; Composition: ThickFilm; Case/Package: 0603; RoHSCompliant: true; Package URL: http://www.st.com/st-web-ui/static/active/en/resource/technical/document/datasheet/CD00001320.pdf; Radiation Hardening: No; Height: 0.022inch; Termination: SMD/SMT; Number of Pins: 2; Package Description: 2-Pin Surface Mount Device, Body 1.6 x 0.85 mm; Datasheet URL: https://industrial.panasonic.com/cdbs/www-data/pdf/RDA0000/AOA0000C283.pdf; Width: 0.031inch; Length: 1.6mm; Datasheet Version: 42095.0; Manufacturer URL: http://www.panasonic.com/; Number of Terminations: 2; Case Code (Imperial): 0603; Depth: 0.8mm; Package Quantity: 1; Package Reference: 0603; Case Code (Metric): 1608; Lead Free: LeadFree; Military Standard: Not; Max Power Dissipation: 100mW; Min Operating Temperature: -55degC; Max Operating Temperature: 155degC; Contact Plating: Tin; Voltage Rating: 75V; Weight: 7.1E-05oz; Mount: SurfaceMount; Packaging: TapeandReel; Tolerance: 1%
R45 = CMP-2000-00195-2: RES SMD 10 OHM 1% 1/10W 0603; Manufacturer: Panasonic; Resistance: 10Ω; Voltage Rating: 75V; Value: 10Ω; Description: 10 Ohms ±1% 0.1W, 1/10W Chip Resistor 0603 (1608 Metric) Automotive AEC-Q200 Thick Film; Power: 100mW; Power Rating: 0.1W; Temperature Coefficient: 100ppm/°C; Automotive Grade: Grade 0; Lead Free: Yes; Device Class L1: Passive Components; Digikey Description: RES SMD 10 OHM 1% 1/10W 0603; Octopart: https://octopart.com/erj-3ekf10r0v-panasonic-55403649; Automotive: Yes; ComponentLink2URL: https://b2b-api.panasonic.eu/file_stream/pids/fileversion/1263; Manufacturer Part Number: ERJ-3EKF10R0V; Height: 0.55mm; Temperature Range High: +155°C; Footprint Url: https://industrial.panasonic.com/cdbs/www-data/pdf/RDA0000/DMA0000COL17.pdf; Temperature: -55°C to +155°C; Tolerance: 1%; ComponentLink2Description: Datasheet; Package: ERJ3EK; Device Class L2: Resistors; Category: Res; Ipc Land Pattern Name: RESC16080X45; RoHS: TRUE; Composition: Thick Film; Device Class L3: Chip SMD Resistors; Temperature Range Low: -55°C; Series: ERJ
R49 = CMP-2000-00319-2: RES SMD 200K OHM 1% 1/10W 0603; Resistance: 200kR; Max Power Dissipation: 100mW; Working Voltage: 75V; Voltage Rating (DC): 50V; Temperature Coefficient: 100ppm/°C; Min Operating Temperature: -55°C; Resistor Type: Thick Film; Max Operating Temperature: 155°C; Packaging: Cut Tape; RoHS Compliant: Yes; Military Standard: Not; Termination: SMD/SMT; Tolerance: 1%; Case Code (Imperial): 0603; Depth: 0.8mm; Lead Free: Lead Free; Resistance Tolerance: 1%; Case Code (Metric): 1608; Mount: Surface Mount; Construction: Rectangular; REACH SVHC: No SVHC; Height: 0.022inch; Radiation Hardening: No; Package Quantity: 1; Voltage Rating: 75V; Contact Plating: Tin; Number of Terminations: 2; Length: 1.6mm; Series: ERJ; Technology: THICK FILM; Features: Automotive AEC-Q200; Case/Package: 0603; Power Rating: 100mW; Width: 0.031inch
TP5-TP8 TP54-TP60 = CMP-00025-2: Test Point .6mm
U4 U6-U8 = CMP-031-00024-2: IC PWR SW USB 1CH 1A SOT-25-5; Source: AP2171WG-7.SchLib; Component Type: Standard; Design Item ID: CMP-019-00057-1; Pins: 5
U5 = CMP-06284-000017-1: IC HUB CTLR USB 56VQFN; Min Operating Temperature: 0°C; Packaging: Tray; Lead Free: Lead Free; Interface: USB; Max Operating Temperature: 70°C
U9 = CMP-0244-00318-1: Fixed Low Drop Positive Voltage Regulator, 1.2V (pn is for 1.5A LDO), 4-Pin SOT-223, Tape and Reel; PackageDescription: 4-Pin SOT-223 Package, 6.5 x 3.5 mm Body, 2.3 mm Pitch, 7 mm Lead Span; PackageVersion: 2010; ComponentLink2Description: Datasheet; PackageReference: SOT-223; ComponentLink2URL: http://www.st.com/internet/com/TECHNICAL_RESOURCES/TECHNICAL_LITERATURE/DATASHEET/CD00000544.pdf; ComponentLink1Description: Manufacturer URL; DatasheetVersion: 1/11/2011; ComponentLink1URL: http://www.st.com
Y2 = CMP-2000-05733-3: Crystal 25MHz ±20ppm (Tol) ±30ppm (Stability) 18pF FUND 60Ω 4-Pin SMD T/R; Series Resistance: 60R; Length: 3.2mm; Depth: 2.5mm; Packaging: Tape and Reel; Min Operating Temperature: -40°C; Operating Frequency: 25 MHz; Lead Free: Lead Free; Number of Pins: 4; Frequency Tolerance: 20ppm; Radiation Hardening: No; Max Operating Temperature: 85°C; Termination: SMD/SMT; Frequency Stability: 30ppm; Frequency: 25MHz; Series: ABM8G; Mount: Surface Mount; Package Quantity: 1000; Height: 0.039inch; Width: 0.098inch; Case/Package: CSMD; ESR (Equivalent Series Resistance): 60R; Load Capacitance: 18pF; Tolerance: 20ppm

## Sheet ETHERNET.SchDoc
size A4; SheetNumber: 5; SheetTotal: 18
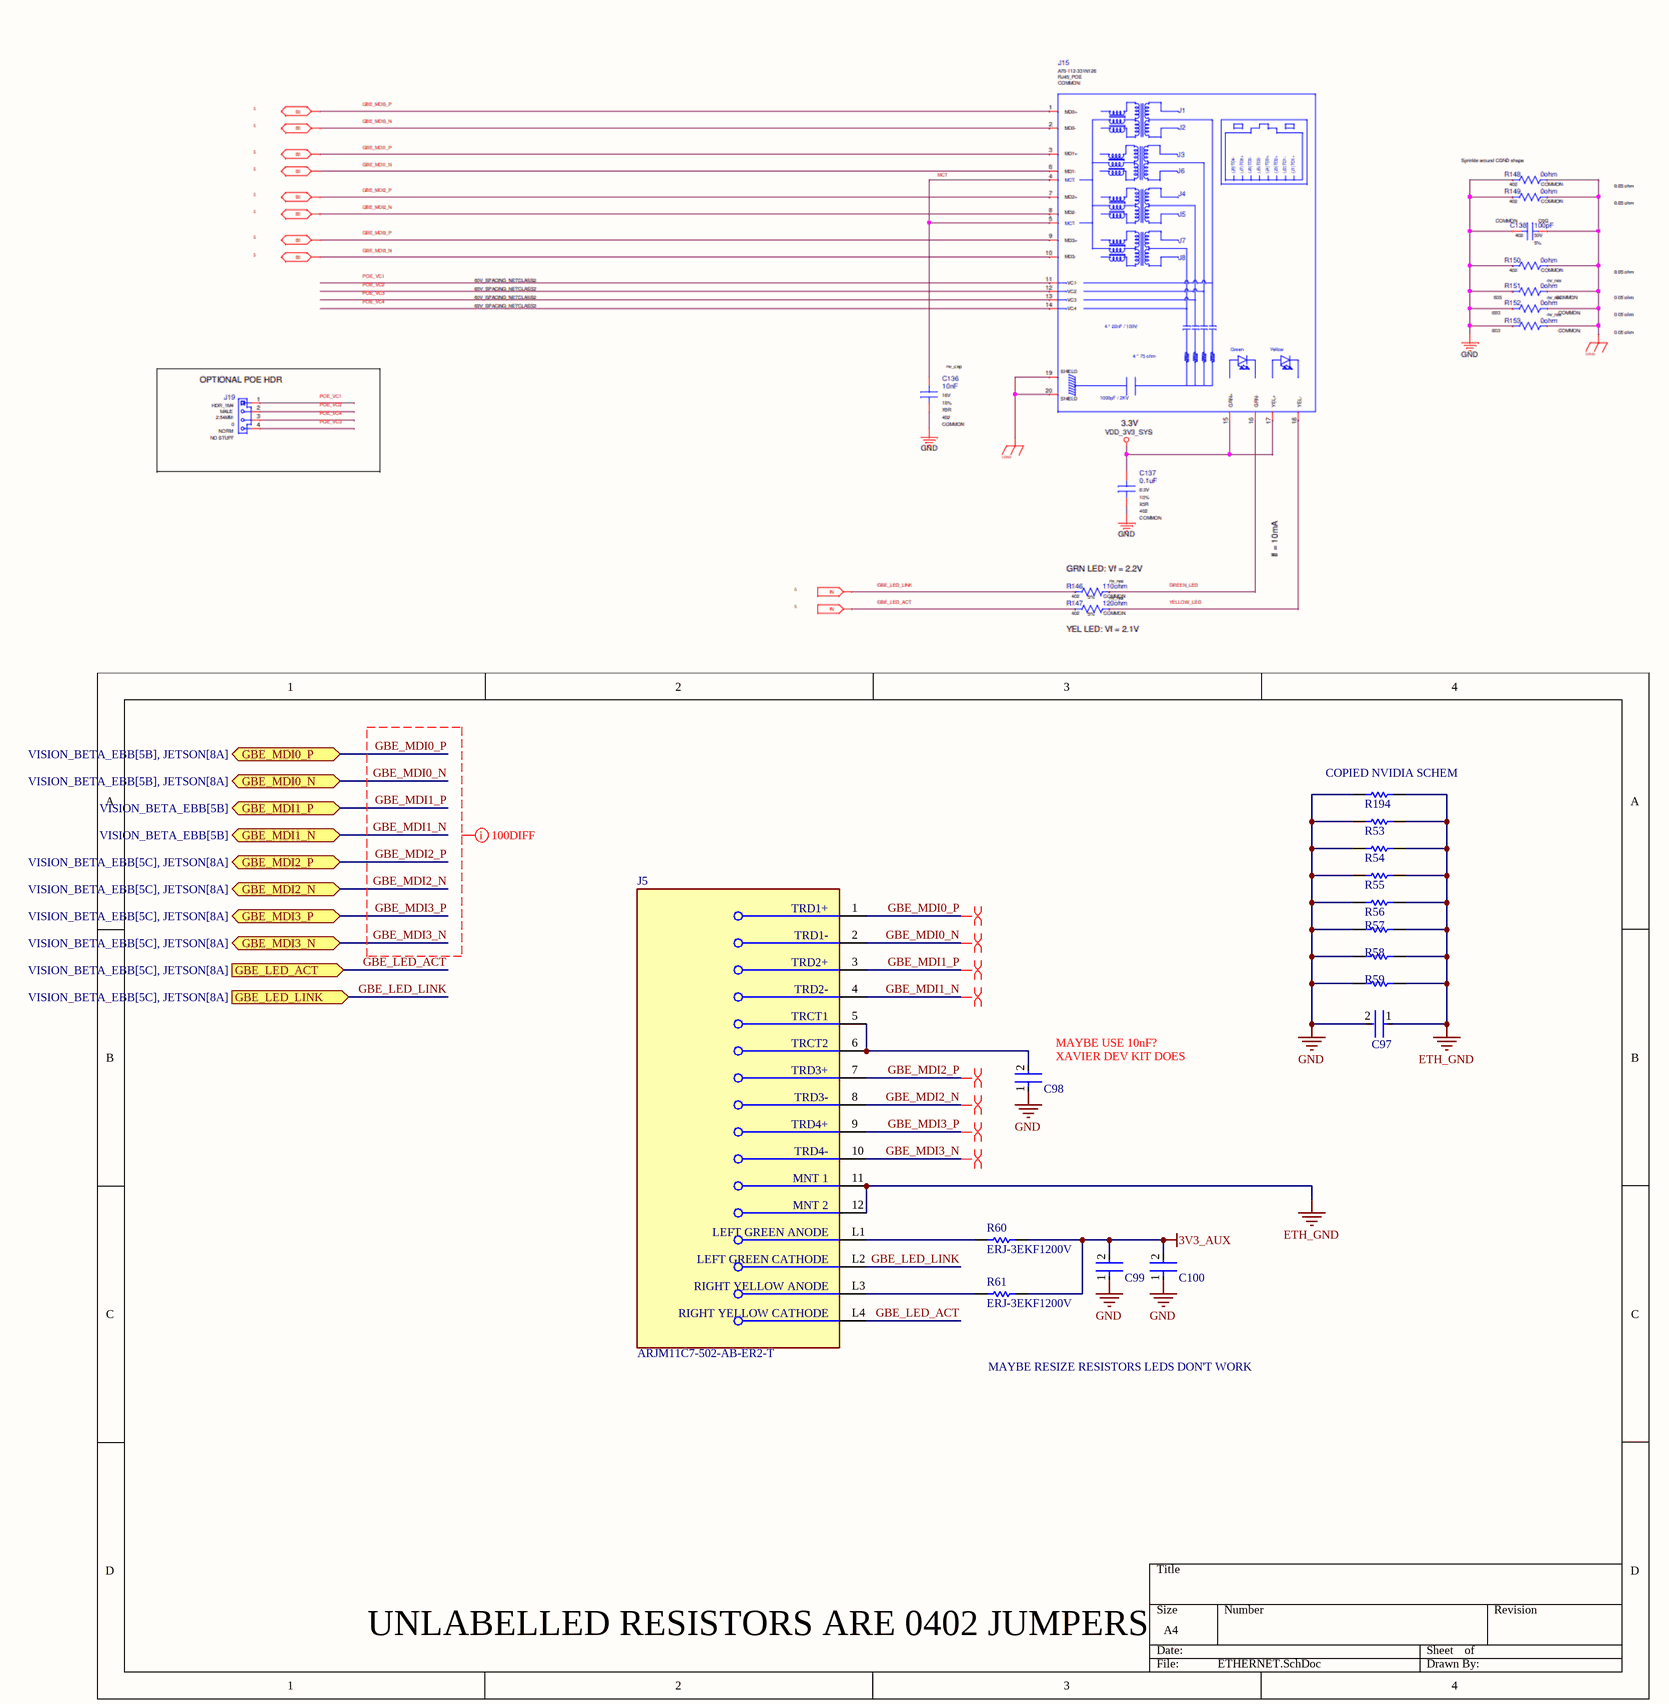
[diagram p18: ETHERNET.SchDoc]

### Parts
C97  C1005X7R1H104K050BB  [FP-C1005-050-0_05-IPC_C]  (value not drawn)
C98  C1005X7R1H104K050BB  [FP-C1005-050-0_05-IPC_C]  (value not drawn)
C99  C1005X7R1H104K050BB  [FP-C1005-050-0_05-IPC_C]  (value not drawn)
C100  C1005X7R1H104K050BB  [FP-C1005-050-0_05-IPC_C]  (value not drawn)
J5  ARJM11C7-502-AB-ER2-T  [FP-ARJM11C7-502-AB-ER2-T-MFG]
R53  0402 JUMPER  [RESC1005X40X25ML05T05]  (value not drawn)
R54  0402 JUMPER  [RESC1005X40X25ML05T05]  (value not drawn)
R55  0402 JUMPER  [RESC1005X40X25ML05T05]  (value not drawn)
R56  0402 JUMPER  [RESC1005X40X25ML05T05]  (value not drawn)
R57  0402 JUMPER  [RESC1005X40X25ML05T05]  (value not drawn)
R58  0402 JUMPER  [RESC1005X40X25ML05T05]  (value not drawn)
R59  0402 JUMPER  [RESC1005X40X25ML05T05]  (value not drawn)
R60  ERJ-3EKF1200V  [RESC1609X55X30ML15T15]
R61  ERJ-3EKF1200V  [RESC1609X55X30ML15T15]
R194  0402 JUMPER  [RESC1005X40X25ML05T05]  (value not drawn)

### Ports
GBE_LED_ACT (in, see VISION_BETA_EBB[5C], JETSON[8A]), GBE_LED_LINK (in, see VISION_BETA_EBB[5C], JETSON[8A]), GBE_MDI0_N (bidir, see VISION_BETA_EBB[5B], JETSON[8A]), GBE_MDI0_P (bidir, see VISION_BETA_EBB[5B], JETSON[8A]), GBE_MDI1_N (bidir, see VISION_BETA_EBB[5B]), GBE_MDI1_P (bidir, see VISION_BETA_EBB[5B]), GBE_MDI2_N (bidir, see VISION_BETA_EBB[5C], JETSON[8A]), GBE_MDI2_P (bidir, see VISION_BETA_EBB[5C], JETSON[8A]), GBE_MDI3_N (bidir, see VISION_BETA_EBB[5C], JETSON[8A]), GBE_MDI3_P (bidir, see VISION_BETA_EBB[5C], JETSON[8A])

### Nets
3V3_AUX: C99.2 C100.2 R60.2 R61.2  [project net 3V3_AUX_FB]
ETH_GND: C97.1 J5.11(MNT_1) J5.12(MNT_2) R53.2 R54.2 R55.2 R56.2 R57.2 R58.2 R59.2 R194.2
GND: C97.2 C98.1 C99.1 C100.1 R53.1 R54.1 R55.1 R56.1 R57.1 R58.1 R59.1 R194.1
GBE_LED_ACT: J5.L4(RIGHT_YELLOW_CATHODE) ; port GBE_LED_ACT
GBE_LED_LINK: J5.L2(LEFT_GREEN_CATHODE) ; port GBE_LED_LINK
GBE_MDI0_N: J5.2(TRD1-) ; port GBE_MDI0_N
GBE_MDI0_P: J5.1(TRD1+) ; port GBE_MDI0_P
GBE_MDI1_N: J5.4(TRD2-) ; port GBE_MDI1_N
GBE_MDI1_P: J5.3(TRD2+) ; port GBE_MDI1_P
GBE_MDI2_N: J5.8(TRD3-) ; port GBE_MDI2_N
GBE_MDI2_P: J5.7(TRD3+) ; port GBE_MDI2_P
GBE_MDI3_N: J5.10(TRD4-) ; port GBE_MDI3_N
GBE_MDI3_P: J5.9(TRD4+) ; port GBE_MDI3_P
NetC98_2: C98.2 J5.5(TRCT1) J5.6(TRCT2)
NetJ5_L1: J5.L1(LEFT_GREEN_ANODE) R60.1
NetJ5_L3: J5.L3(RIGHT_YELLOW_ANODE) R61.1

### Layout directives
differential pair: GBE_MDI0_N, GBE_MDI0_P, GBE_MDI1_N, GBE_MDI1_P, GBE_MDI2_N, GBE_MDI2_P, GBE_MDI3_N, GBE_MDI3_P
net class 100DIFF: GBE_MDI0_N, GBE_MDI0_P, GBE_MDI1_N, GBE_MDI1_P, GBE_MDI2_N, GBE_MDI2_P, GBE_MDI3_N, GBE_MDI3_P

### Notes on the sheet
- (near R194) COPIED NVIDIA SCHEM
- (near C98) MAYBE USE 10nF?
- (near C98) XAVIER DEV KIT DOES
- MAYBE RESIZE RESISTORS LEDS DON'T WORK
- UNLABELLED RESISTORS ARE 0402 JUMPERS

### Library data of the parts
C97-C100 = CMP-2000-05393-2: as C214 on sheet JETSON; Voltage: 50V; Dielectric Material: Ceramic; Min Operating Temperature: -55°C; Depth: 0.5mm; Radiation Hardening: No; RoHS Compliant: Yes; Voltage Rating (DC): 50V; Lead Free: Lead Free; Resistor Type: Ceramic; Height: 0.5mm; Dielectric: X7R; Thickness: 0.022inch; Case/Package: 0402; Case Code (Metric): 1005; Termination: SMD/SMT; Capacitance: 100nF; Packaging: Tape and Reel; Max Operating Temperature: 125°C; Mount: Surface Mount; Package Quantity: 1; Width: 0.02inch; Weight: 2.3E-05oz; Voltage Rating: 50V; Tolerance: 10%; Construction: Flat; Case Code (Imperial): 0402; Length: 1mm; REACH SVHC: No SVHC; Series: C
J5 = CMP-27893-000001-1: RJ45 JACK W/MAG 1X1 1000BASE-T; Manufacturer: Abracon; Conn Gender: Female; Is Female: yes; Shielding: true; Pitch: 1.27mm; Number Of Contacts: 10; Conn Orientation: Right Angle; RoHS: TRUE; Digikey Description: RJ45 JACK W/MAG 1X1 1000BASE-T; Temperature Range Low: -40°C; ComponentLink2Description: Datasheet; Category: Conn; Temperature Range High: +85°C; Package: 0; Device Class L1: Connectors; Manufacturer Part Number: ARJM11C7-502-AB-ER2-T; ComponentLink2URL: https://abracon.com/Magnetics/ARJM11.pdf; Automotive: No; Contact Material: Gold; Height: 15.8mm; Lead Free: Yes; Temperature: -40°C to +85°C; Device Class L2: Modular / Ethernet Connectors; Device Class L3: unset; Octopart: https://octopart.com/arjm11c7-502-ab-er2-t-abracon-86945316
R53-R59 R194 = CMP-009-00118-2: READ THE NAME; Pins: 2; Component Type: Standard; Design Item ID: CMP-009-00206-2; Source: 0402jump.SchLib
R60 R61 = CMP-2000-00213-2: Chip Resistor, 120 Ohm, +/- 1%, 0.1 W, -55 to 155 degC, 0603 (1608 Metric), RoHS, Tape and Reel; Manufacturer: Panasonic; Power Rating: 100mW; Voltage Rating (DC): 75V; Resistance: 120Ohm; Temperature Coefficient: 100ppm/degreesC; Number of Terminations: 2; Military Standard: Not; Tolerance: 1%; Min Operating Temperature: -55degC; Packaging: TapeandReel; Lead Free: LeadFree; Max Operating Temperature: 155degC; Manufacturer URL: http://www.panasonic.com/; Case Code (Imperial): 0603; REACH SVHC: NoSVHC; Width: 0.031inch; Datasheet URL: https://industrial.panasonic.com/cdbs/www-data/pdf/RDA0000/AOA0000C283.pdf; RoHSCompliant: true; Max Power Dissipation: 100mW; Termination: SMD/SMT; Package Reference: 0603; Height: 0.022inch; Depth: 0.8mm; Package Description: 2-Pin Surface Mount Device, Body 1.6 x 0.85 mm; Contact Plating: Tin; Length: 1.6mm; Package URL: http://www.st.com/st-web-ui/static/active/en/resource/technical/document/datasheet/CD00001320.pdf; Radiation Hardening: No; Package Quantity: 1; Number of Pins: 2; Datasheet Version: 42095.0; Voltage Rating: 75V; Composition: ThickFilm; Case/Package: 0603; Mount: SurfaceMount; Case Code (Metric): 1608